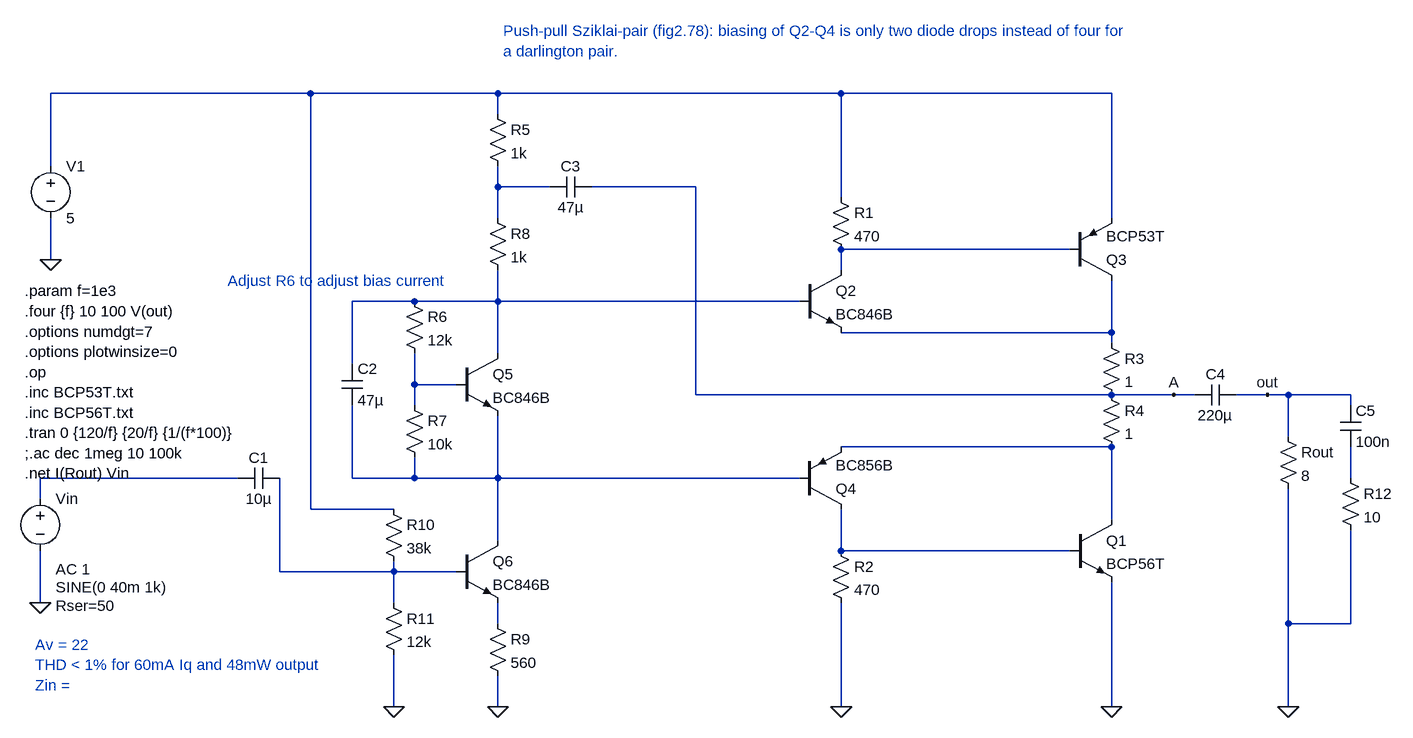
[diagram p0: schematic AoE_SMD_with_amp.asc]
AoE_SMD_with_amp.asc, the LTspice schematic file:
Version 4
SHEET 1 2568 680
WIRE 576 -368 176 -368
WIRE 864 -368 576 -368
WIRE 1392 -368 864 -368
WIRE 1808 -368 1392 -368
WIRE 864 -336 864 -368
WIRE 176 -256 176 -368
WIRE 864 -224 864 -256
WIRE 944 -224 864 -224
WIRE 1168 -224 1008 -224
WIRE 1392 -208 1392 -368
WIRE 864 -176 864 -224
WIRE 1808 -176 1808 -368
WIRE 1744 -128 1392 -128
WIRE 176 -112 176 -176
WIRE 1392 -96 1392 -128
WIRE 736 -48 640 -48
WIRE 864 -48 864 -96
WIRE 864 -48 736 -48
WIRE 1328 -48 864 -48
WIRE 1808 0 1808 -80
WIRE 1808 0 1392 0
WIRE 1808 16 1808 0
WIRE 864 32 864 -48
WIRE 640 48 640 -48
WIRE 736 80 736 32
WIRE 800 80 736 80
WIRE 1168 96 1168 -224
WIRE 1808 96 1168 96
WIRE 1904 96 1808 96
WIRE 1936 96 1904 96
WIRE 2048 96 2000 96
WIRE 2080 96 2048 96
WIRE 2176 96 2080 96
WIRE 736 112 736 80
WIRE 2176 112 2176 96
WIRE 2080 160 2080 96
WIRE 1808 176 1392 176
WIRE 464 224 160 224
WIRE 640 224 640 112
WIRE 736 224 736 192
WIRE 736 224 640 224
WIRE 864 224 864 128
WIRE 864 224 736 224
WIRE 1328 224 864 224
WIRE 2176 224 2176 176
WIRE 160 256 160 224
WIRE 576 272 576 -368
WIRE 704 272 576 272
WIRE 1808 288 1808 176
WIRE 864 320 864 224
WIRE 1392 336 1392 272
WIRE 1744 336 1392 336
WIRE 528 368 528 224
WIRE 704 368 704 352
WIRE 704 368 528 368
WIRE 800 368 704 368
WIRE 160 416 160 336
WIRE 704 416 704 368
WIRE 864 448 864 416
WIRE 2080 448 2080 240
WIRE 2176 448 2176 304
WIRE 2176 448 2080 448
WIRE 704 576 704 496
WIRE 864 576 864 528
WIRE 1392 576 1392 416
WIRE 1808 576 1808 384
WIRE 2080 576 2080 448
FLAG 176 -112 0
FLAG 160 416 0
FLAG 1808 576 0
FLAG 1392 576 0
FLAG 2080 576 0
FLAG 2048 96 out
FLAG 1904 96 A
FLAG 864 576 0
FLAG 704 576 0
DATAFLAG 1056 -48 ""
DATAFLAG 1072 224 ""
DATAFLAG 1568 -128 ""
DATAFLAG 1600 336 ""
DATAFLAG 1328 96 ""
SYMBOL npn 1744 288 R0
SYMATTR InstName Q1
SYMATTR Value BCP56T
SYMATTR Prefix X
SYMBOL pnp 1744 -80 M180
SYMATTR InstName Q3
SYMATTR Value BCP53T
SYMATTR Prefix X
SYMBOL voltage 176 -272 R0
SYMATTR InstName V1
SYMATTR Value 5
SYMBOL cap 528 208 R90
WINDOW 0 0 32 VBottom 2
WINDOW 3 32 32 VTop 2
SYMATTR InstName C1
SYMATTR Value 10µ
SYMBOL voltage 160 240 R0
WINDOW 3 24 152 Left 2
WINDOW 123 24 124 Left 2
WINDOW 39 24 180 Left 2
SYMATTR Value SINE(0 40m 1k)
SYMATTR Value2 AC 1
SYMATTR SpiceLine Rser=50
SYMATTR InstName Vin
SYMBOL res 1376 -224 R0
SYMATTR InstName R1
SYMATTR Value 470
SYMBOL res 1376 320 R0
SYMATTR InstName R2
SYMATTR Value 470
SYMBOL npn 1328 -96 R0
SYMATTR InstName Q2
SYMATTR Value BC846B
SYMBOL pnp 1328 272 M180
SYMATTR InstName Q4
SYMATTR Value BC856B
SYMBOL res 1792 0 R0
SYMATTR InstName R3
SYMATTR Value 1
SYMBOL res 1792 80 R0
SYMATTR InstName R4
SYMATTR Value 1
SYMBOL res 848 -352 R0
SYMATTR InstName R5
SYMATTR Value 1k
SYMBOL npn 800 32 R0
SYMATTR InstName Q5
SYMATTR Value BC846B
SYMBOL res 720 -64 R0
SYMATTR InstName R6
SYMATTR Value 12k
SYMBOL res 720 96 R0
SYMATTR InstName R7
SYMATTR Value 10k
SYMBOL cap 624 48 R0
SYMATTR InstName C2
SYMATTR Value 47µ
SYMBOL cap 2000 80 R90
WINDOW 0 0 32 VBottom 2
WINDOW 3 32 32 VTop 2
SYMATTR InstName C4
SYMATTR Value 220µ
SYMBOL res 2064 144 R0
SYMATTR InstName Rout
SYMATTR Value 8
SYMBOL cap 1008 -240 R90
WINDOW 0 0 32 VBottom 2
WINDOW 3 32 32 VTop 2
SYMATTR InstName C3
SYMATTR Value 47µ
SYMBOL res 848 -192 R0
SYMATTR InstName R8
SYMATTR Value 1k
SYMBOL res 2160 208 R0
SYMATTR InstName R12
SYMATTR Value 10
SYMBOL cap 2160 112 R0
SYMATTR InstName C5
SYMATTR Value 100n
SYMBOL npn 800 320 R0
SYMATTR InstName Q6
SYMATTR Value BC846B
SYMBOL res 848 432 R0
SYMATTR InstName R9
SYMATTR Value 560
SYMBOL res 688 256 R0
SYMATTR InstName R10
SYMATTR Value 38k
SYMBOL res 688 400 R0
SYMATTR InstName R11
SYMATTR Value 12k
TEXT 136 -64 Left 2 !.param f=1e3\n.four {f} 10 100 V(out)\n.options numdgt=7\n.options plotwinsize=0\n.op\n.inc BCP53T.txt\n.inc BCP56T.txt\n.tran 0 {120/f} {20/f} {1/(f*100)}\n;.ac dec 1meg 10 100k\n.net I(Rout) Vin
TEXT 152 480 Left 2 ;Av = 22\nTHD < 1% for 60mA Iq and 48mW output\nZin =
TEXT 448 -80 Left 2 ;Adjust R6 to adjust bias current
TEXT 872 -464 Left 2 ;Push-pull Sziklai-pair (fig2.78): biasing of Q2-Q4 is only two diode drops instead of four for \na darlington pair.

The netlist it stands for:
* AoE_SMD_with_amp.asc
XQ1 N007 N011 0 BCP56T  ; pins C B E
XQ3 N005 N003 N001 BCP53T  ; pins C B E
V1 N001 0 5
C1 N012 N008 10µ
Vin N008 0 SINE(0 40m 1k) AC 1 Rser=50
R1 N001 N003 470
R2 N011 0 470
Q2 N003 N004 N005 0 BC846B
Q4 N011 N009 N007 0 BC856B
R3 N005 A 1
R4 A N007 1
R5 N001 N002 1k
Q5 N004 N006 N009 0 BC846B
R6 N004 N006 12k
R7 N006 N009 10k
C2 N004 N009 47µ
C4 out A 220µ
Rout out 0 8
C3 A N002 47µ
R8 N002 N004 1k
R12 N010 0 10
C5 out N010 100n
Q6 N009 N012 N013 0 BC846B
R9 N013 0 560
R10 N001 N012 38k
R11 N012 0 12k
.model NPN NPN
.model PNP PNP
.lib standard.bjt
.param f=1e3
.four {f} 10 100 V(out)
.options numdgt=7
.options plotwinsize=0
.op
.inc BCP53T.txt
.inc BCP56T.txt
.tran 0 {120/f} {20/f} {1/(f*100)}
;.ac dec 1meg 10 100k
.net I(Rout) Vin
* Av = 22
* THD < 1% for 60mA Iq and 48mW output
* Zin =
* Adjust R6 to adjust bias current
* Push-pull Sziklai-pair (fig2.78): biasing of Q2-Q4 is only two diode drops instead of four for
* a darlington pair.
.backanno
.end